# Altium schematic sheet iso_GPIO_4in_4out.SchDoc: foxBMS BMS-Extension
size A3; DocumentNumber: 12; SheetNumber: 12; SheetTotal: 14; Author: Fraunhofer IISB foxBMS Team; REL-DATE: 2017-05-16; VERSION: 1.0.2; GateName_1: G$1; SymbolName_1: FRAME_B_L; LibraryName: foxBMS_BMS-Master_V1.00_A; DeviceSetName: FRAME_B_L; GateName_2: G$2; SymbolName_2: DOCFIELD; SheetDescription: Isolated GPIO 4x In / 4x Out
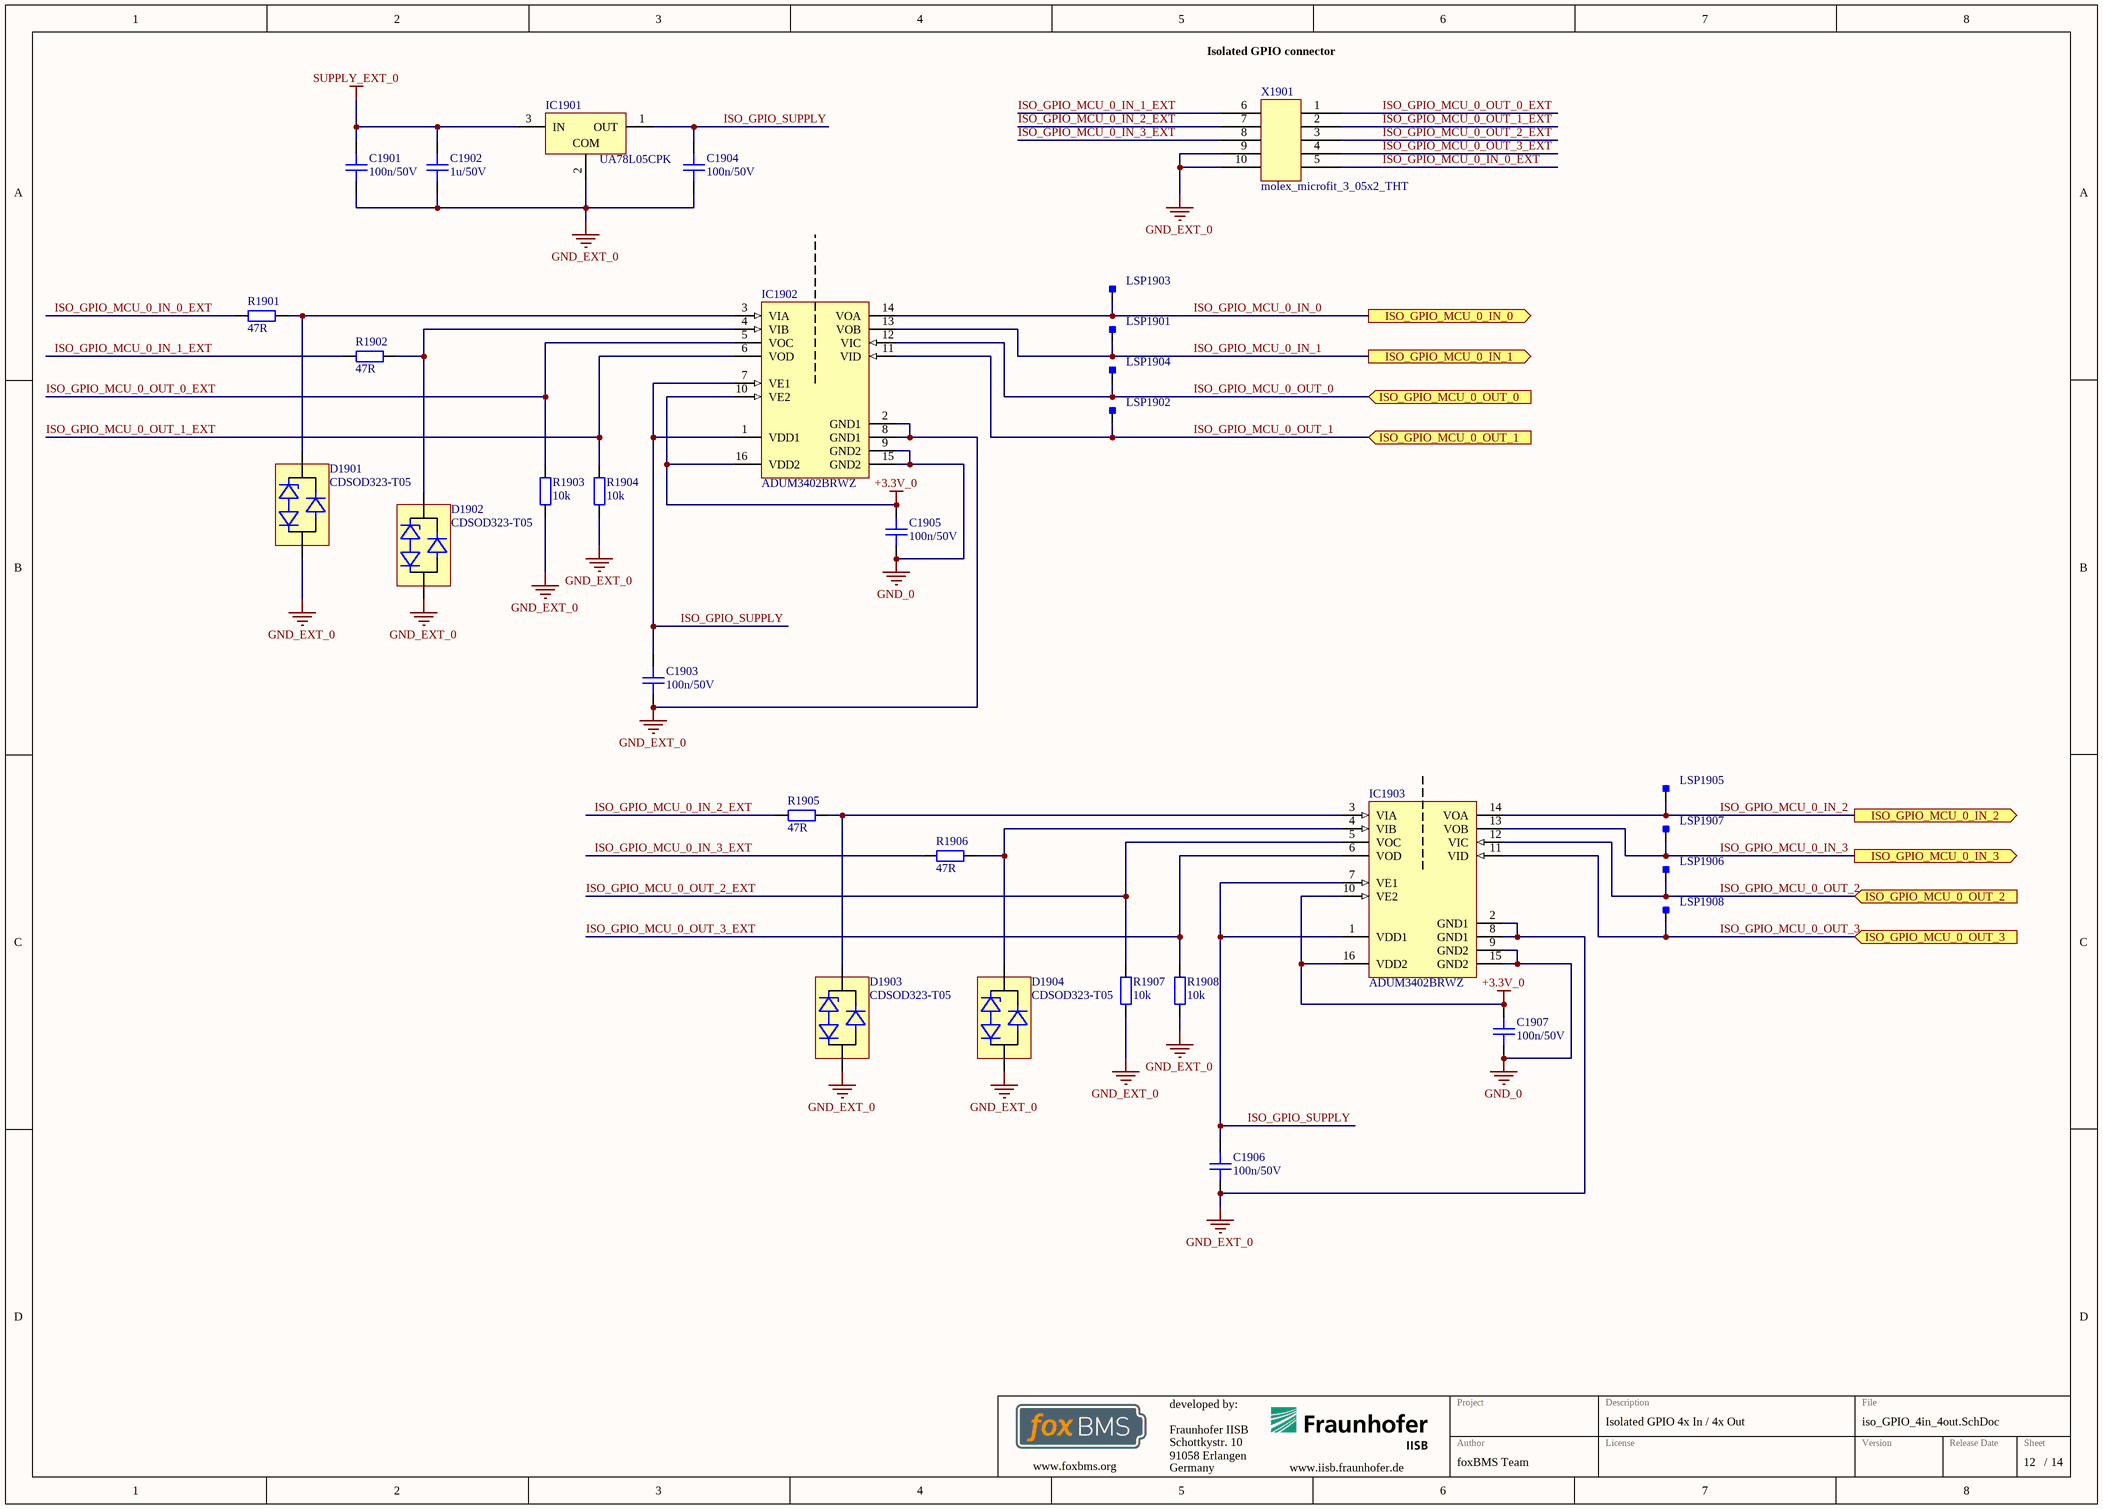
[diagram p0: iso_GPIO_4in_4out.SchDoc]

## Parts
C1901  100n/50V  [CAPC1608X08N]
C1902  1u/50V  [CAPC1608X08N]
C1903  100n/50V  [CAPC1608X08N]
C1904  100n/50V  [CAPC1608X08N]
C1905  100n/50V  [CAPC1608X08N]
C1906  100n/50V  [CAPC1608X08N]
C1907  100n/50V  [CAPC1608X08N]
D1901  CDSOD323-T05  [SODFL250X110-2N]
D1902  CDSOD323-T05  [SODFL250X110-2N]
D1903  CDSOD323-T05  [SODFL250X110-2N]
D1904  CDSOD323-T05  [SODFL250X110-2N]
IC1901  UA78L05CPK  [PK0003A_L]
IC1902  ADUM3402BRWZ  [ADI-RW-16_N]
IC1903  ADUM3402BRWZ  [ADI-RW-16_N]
LSP1901  Testpoint_Square  [Testpoint_S1]  (value not drawn)  (no BOM)
LSP1902  Testpoint_Square  [Testpoint_S1]  (value not drawn)  (no BOM)
LSP1903  Testpoint_Square  [Testpoint_S1]  (value not drawn)  (no BOM)
LSP1904  Testpoint_Square  [Testpoint_S1]  (value not drawn)  (no BOM)
LSP1905  Testpoint_Square  [Testpoint_S1]  (value not drawn)  (no BOM)
LSP1906  Testpoint_Square  [Testpoint_S1]  (value not drawn)  (no BOM)
LSP1907  Testpoint_Square  [Testpoint_S1]  (value not drawn)  (no BOM)
LSP1908  Testpoint_Square  [Testpoint_S1]  (value not drawn)  (no BOM)
R1901  47R  [RESC1608X05N]
R1902  47R  [RESC1608X05N]
R1903  10k  [RESC1608X05N]
R1904  10k  [RESC1608X05N]
R1905  47R  [RESC1608X05N]
R1906  47R  [RESC1608X05N]
R1907  10k  [RESC1608X05N]
R1908  10k  [RESC1608X05N]
X1901  molex_microfit_3_05x2_THT  [43045-1021]

## Ports
ISO_GPIO_MCU_0_IN_0 (out), ISO_GPIO_MCU_0_IN_1 (out), ISO_GPIO_MCU_0_IN_2 (out), ISO_GPIO_MCU_0_IN_3 (out), ISO_GPIO_MCU_0_OUT_0 (in), ISO_GPIO_MCU_0_OUT_1 (in), ISO_GPIO_MCU_0_OUT_2 (in), ISO_GPIO_MCU_0_OUT_3 (in)

## Nets
+3.3V_0: C1905.1 C1907.1 IC1902.10(VE2) IC1902.16(VDD2) IC1903.10(VE2) IC1903.16(VDD2)
GND_0: C1905.2 C1907.2 IC1902.9(GND2) IC1902.15(GND2) IC1903.9(GND2) IC1903.15(GND2)
GND_EXT_0: C1901.2 C1902.2 C1903.2 C1904.2 C1906.2 D1901.2(A) D1902.2(A) D1903.2(A) D1904.2(A) IC1901.2(COM) IC1902.2(GND1) IC1902.8(GND1) IC1903.2(GND1) IC1903.8(GND1) R1903.1 R1904.1 R1907.1 R1908.1 X1901.9 X1901.10
SUPPLY_EXT_0: C1901.1 C1902.1 IC1901.3(IN)
ISO_GPIO_MCU_0_IN_0: IC1902.14(VOA) LSP1903.1 ; port ISO_GPIO_MCU_0_IN_0
ISO_GPIO_MCU_0_IN_0_EXT: R1901.2 X1901.5
ISO_GPIO_MCU_0_IN_1: IC1902.13(VOB) LSP1901.1 ; port ISO_GPIO_MCU_0_IN_1
ISO_GPIO_MCU_0_IN_1_EXT: R1902.2 X1901.6
ISO_GPIO_MCU_0_IN_2: IC1903.14(VOA) LSP1905.1 ; port ISO_GPIO_MCU_0_IN_2
ISO_GPIO_MCU_0_IN_2_EXT: R1905.2 X1901.7
ISO_GPIO_MCU_0_IN_3: IC1903.13(VOB) LSP1907.1 ; port ISO_GPIO_MCU_0_IN_3
ISO_GPIO_MCU_0_IN_3_EXT: R1906.2 X1901.8
ISO_GPIO_MCU_0_OUT_0: IC1902.12(VIC) LSP1904.1 ; port ISO_GPIO_MCU_0_OUT_0
ISO_GPIO_MCU_0_OUT_0_EXT: IC1902.5(VOC) R1903.2 X1901.1
ISO_GPIO_MCU_0_OUT_1: IC1902.11(VID) LSP1902.1 ; port ISO_GPIO_MCU_0_OUT_1
ISO_GPIO_MCU_0_OUT_1_EXT: IC1902.6(VOD) R1904.2 X1901.2
ISO_GPIO_MCU_0_OUT_2: IC1903.12(VIC) LSP1906.1 ; port ISO_GPIO_MCU_0_OUT_2
ISO_GPIO_MCU_0_OUT_2_EXT: IC1903.5(VOC) R1907.2 X1901.3
ISO_GPIO_MCU_0_OUT_3: IC1903.11(VID) LSP1908.1 ; port ISO_GPIO_MCU_0_OUT_3
ISO_GPIO_MCU_0_OUT_3_EXT: IC1903.6(VOD) R1908.2 X1901.4
ISO_GPIO_SUPPLY: C1903.1 C1904.1 C1906.1 IC1901.1(OUT) IC1902.1(VDD1) IC1902.7(VE1) IC1903.1(VDD1) IC1903.7(VE1)
NetD1901_1: D1901.1(K) IC1902.3(VIA) R1901.1
NetD1902_1: D1902.1(K) IC1902.4(VIB) R1902.1
NetD1903_1: D1903.1(K) IC1903.3(VIA) R1905.1
NetD1904_1: D1904.1(K) IC1903.4(VIB) R1906.1

## Notes on the sheet
- Isolated GPIO connector
- Fraunhofer IISB
- Schottkystr. 10
- developed by:
- 91058 Erlangen
- Germany
- Author
- Project
- License
- Description
- File
- Version
- Release Date
- Sheet
- www.foxbms.org
- www.iisb.fraunhofer.de
- foxBMS Team
- /

## Library data of the parts
C1901 C1903-C1907 = gen_C_ceramic_100n_50V_X7R_0603: MLCC; Capacitance: 100n; Rated Voltage: 50V; Dielectric: X7R; Case EIA: 0603; Case Metric: 1608; PnP Package: C_0603_10; PnP Value: 100n/50V/X7R; PnP equipped: x; Part Number: gen_C_ceramic_100n_50V_X7R_0603; Supplier 1: Farnell; Supplier Part Number 1: 2525267
C1902 = gen_C_ceramic_1u_50V_X7R_0603: MLCC; Capacitance: 1u; Rated Voltage: 50V; Dielectric: X7R; Tolerance: ± 10%; Case EIA: 0603; Case Metric: 1608; Part Number: gen_C_ceramic_1u_50V_X7R_0603; Operating Temperature: -55°C - +125°C; Supplier 1: Farnell; Supplier Part Number 1: 2779055
D1901-D1904 = CDSOD323-T05: TVS Diode, CDSOD323 Series, Unidirectional, 5 V, 18.3 V, SOD-323, 2 Pins; Manufacturer: Bourns; Breakdown Voltage: 6V; Part Number: CDSOD323-T05; Part Name: CDSOD323-T05; Operating Temperature: -55°C - +150°C; ComponentLink1Description: Datasheet; ComponentLink1URL: http://www.farnell.com/datasheets/1845299.pdf; Supplier 1: Farnell; Supplier Part Number 1: 2341914
IC1901 = CMP-2000-07341-1: Positive-Voltage Regulator, 100 mA, 0 to 125 degC, 3-Pin SOT-89 (PK), Green (RoHS & no Sb/Br), Tape and Reel; Manufacturer: TexasInstruments; Load Regulation: 60mV; Input Voltage MIN: 7V; Number of Outputs: 1; Input Voltage MAX: 20V; Output Type: Fixed; Output Current: 100mA; Output Voltage: 5V; PSRR / Ripple Rejection - Typ: 49dB; Line Regulation: 200mV; Mounting Style: SMD/SMT; Datasheet Version: Rev. U, 05/2011; Polarity: Positive; Minimum Operating Temperature: 0C; Package Reference: PK0003A; Brand: TexasInstruments; Packaging: Reel; Product Category: LinearVoltageRegulators; RoHS: True; Datasheet URL: http://www.ti.com/lit/ds/symlink/ua78l05.pdf; Package URL: http://www.ti.com/lit/ml/mhsi001b/mhsi001b.pdf; Series: UA78L05; Manufacturer URL: http://www.ti.com/; Package Description: 3-Pin Small Outline Transistor, Body 4.5 x 2.5 mm, Pitch 1.5 mm; Mounting Technology: SurfaceMount; Package / Case: SOT-89-4; Maximum Operating Temperature: +125C
IC1902 IC1903 = CMP-0534-00413-1: Quad Channel Digital Isolator, Enhanced System-Level ESD Reliability, 2.5 KV rms Insulation Rating, 10 Mbps Data Rate, 50 ns Delay, Industrial, 16-pin SOIC (RW-16), Tube; Manufacturer: Analog Devices; Max Data Rate: 10Mbps; Insulation Rating (kVrms): 2.5; PackageVersion: 032707-B, 03/2007; ComponentLink4Description: URL Link1; ComponentLink2Description: Datasheet; ComponentLink3URL: http://www.analog.com/static/imported-files/packages/PKG_PDF/SOIC_WIDE%20%28RW%29/RW_16.pdf; PackageDescription: 16-Pin Standard Small Outline Package, Body 10.3 x 7.5 mm, Pitch 1.27 mm; PackageReference: RW-16; ComponentLink4URL: Product URL:http://www.analog.com/en/interface-isolation/digital-isolators/adum3402/products/product.html; Mounting Technology: Surface Mount; PartNumber: ADUM3402BRWZ; ComponentLink2URL: http://www.analog.com/static/imported-files/data_sheets/ADUM3400_3401_3402.pdf; ComponentLink3Description: Package Specification; Code_JEDEC: MS-013-AA; Max Operating Temp (degreesC): 105; ComponentLink1URL: http://www.analog.com/en/index.html; ComponentLink1Description: Manufacturer URL; DatasheetVersion: Rev. B
LSP1901-LSP1908 = Testpoint_Square: Testpoint, square; Part Number: Testpoint_Square
R1901 R1902 R1905 R1906 = gen_R_47R_0603: SMD Resistor 47R 0603; Tolerance: 1%; Power: 0.1W; Case EIA: 0603; Case Metric: 1608; Maximum Working Voltage: 75V; PnP Package: R_0603; Part Number: gen_R_47R_0603; Operating Temperature: -55°C - +155°C; Resistance: 47R; Series: E24; PnP Value: 47R; Supplier 1: Farnell; Supplier Part Number 1: 2303030
R1903 R1904 R1907 R1908 = gen_R_10k_0603: SMD Resistor 10k 0603; Tolerance: 1%; Power: 0.1W; Case EIA: 0603; Case Metric: 1608; Maximum Working Voltage: 75V; PnP Package: R_0603; Part Number: gen_R_10k_0603; Operating Temperature: -55°C - +155°C; Resistance: 10k; Series: E24, E96; PnP Value: 10k; Supplier 1: Farnell; Supplier Part Number 1: 2073349
X1901 = molex_microfit_3_05x2_THT: Micro-Fit 3.0 Right Angle Header, 3.00mm Pitch, Dual Row, 10 Circuits, with Snap-in Plastic Peg PCB Lock, Tin, Glow Wire Capable, Black, 43045-1000; Manufacturer: Molex; Circuits: 10; Rated Voltage: 600V; Rated Current: 8.5A; Part Number: molex_microfit_3_05x2_THT; Part Name: MicroFit; Operating Temperature: -40°C - +105°C; Supplier 1: Farnell; Supplier Part Number 1: 1012255